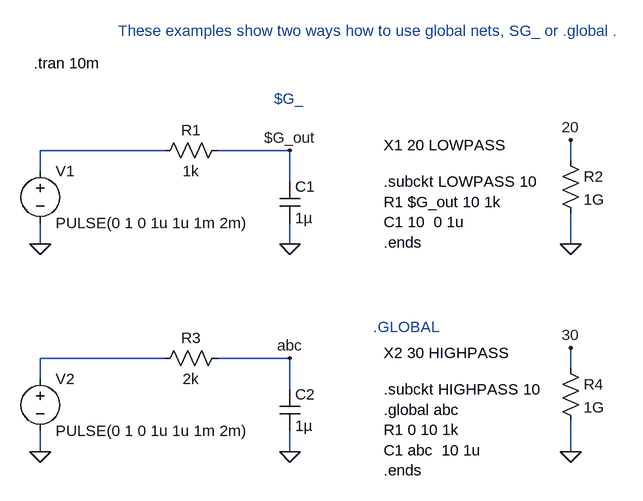
[diagram p0: schematic global2.asc]
global2.asc, the LTspice schematic file:
Version 4
SHEET 1 976 680
WIRE -16 160 -16 128
WIRE -16 272 -16 240
WIRE -16 480 -16 448
WIRE -16 592 -16 560
WIRE 176 128 -16 128
WIRE 176 448 -16 448
WIRE 368 128 256 128
WIRE 368 176 368 128
WIRE 368 272 368 240
WIRE 368 448 256 448
WIRE 368 496 368 448
WIRE 368 592 368 560
WIRE 800 144 800 112
WIRE 800 272 800 224
WIRE 800 464 800 432
WIRE 800 592 800 544
FLAG -16 272 0
FLAG 368 272 0
FLAG 368 128 $G_out
FLAG 800 112 20
FLAG 800 272 0
FLAG -16 592 0
FLAG 368 592 0
FLAG 368 448 abc
FLAG 800 432 30
FLAG 800 592 0
SYMBOL voltage -16 144 R0
WINDOW 123 0 0 Left 0
WINDOW 39 0 0 Left 0
SYMATTR InstName V1
SYMATTR Value PULSE(0 1 0 1u 1u 1m 2m)
SYMBOL res 160 144 R270
WINDOW 0 32 56 VTop 0
WINDOW 3 0 56 VBottom 0
SYMATTR InstName R1
SYMATTR Value 1k
SYMBOL cap 352 176 R0
SYMATTR InstName C1
SYMATTR Value 1µ
SYMBOL res 784 128 R0
SYMATTR InstName R2
SYMATTR Value 1G
SYMBOL voltage -16 464 R0
WINDOW 123 0 0 Left 0
WINDOW 39 0 0 Left 0
SYMATTR InstName V2
SYMATTR Value PULSE(0 1 0 1u 1u 1m 2m)
SYMBOL res 160 464 R270
WINDOW 0 32 56 VTop 0
WINDOW 3 0 56 VBottom 0
SYMATTR InstName R3
SYMATTR Value 2k
SYMBOL cap 352 496 R0
SYMATTR InstName C2
SYMATTR Value 1µ
SYMBOL res 784 448 R0
SYMATTR InstName R4
SYMATTR Value 1G
TEXT -26 -6 Left 0 !.tran 10m
TEXT 512 120 Left 0 !X1 20 LOWPASS
TEXT 512 176 Left 0 !.subckt LOWPASS 10\nR1 $G_out 10 1k\nC1 10  0 1u\n.ends
TEXT 512 440 Left 0 !X2 30 HIGHPASS
TEXT 512 496 Left 0 !.subckt HIGHPASS 10\n.global abc\nR1 0 10 1k\nC1 abc  10 1u\n.ends
TEXT 104 -56 Left 0 ;These examples show two ways how to use global nets, SG_ or .global .
TEXT 496 400 Left 0 ;.GLOBAL
TEXT 344 48 Left 0 ;$G_

The netlist it stands for:
* global2.asc
V1 N001 0 PULSE(0 1 0 1u 1u 1m 2m)
R1 N001 $G_out 1k
C1 $G_out 0 1µ
R2 20 0 1G
V2 N002 0 PULSE(0 1 0 1u 1u 1m 2m)
R3 N002 abc 2k
C2 abc 0 1µ
R4 30 0 1G
.tran 10m
X1 20 LOWPASS
.subckt LOWPASS 10
R1 $G_out 10 1k
C1 10  0 1u
.ends
X2 30 HIGHPASS
.subckt HIGHPASS 10
.global abc
R1 0 10 1k
C1 abc  10 1u
.ends
* These examples show two ways how to use global nets, SG_ or .global .
* .GLOBAL
* $G_
.backanno
.end